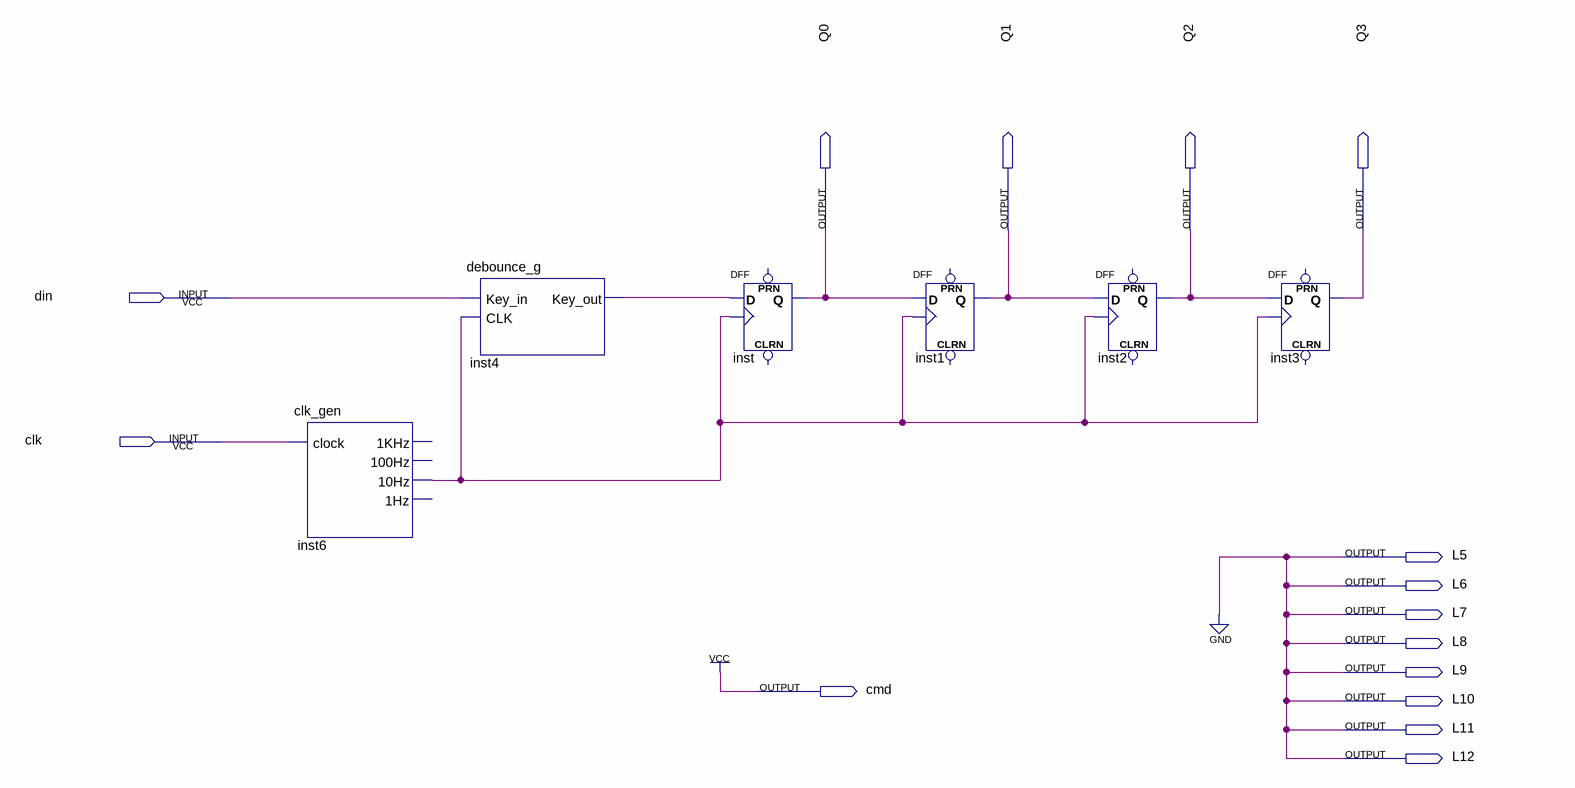
[diagram p0: schematic sheet]
// Quartus schematic shift.bdf as structural Verilog: 6 symbols, 15 pins
module shift (
  input  din,
  input  clk,
  output Q0,
  output Q1,
  output Q2,
  output Q3,
  output L5,
  output L6,
  output L7,
  output L8,
  output L9,
  output cmd,
  output L10,
  output L11,
  output L12
);

  wire inst4_key_out, inst6_10hz;

  clk_gen inst6 (.clock(clk), .\10Hz (inst6_10hz));  // open: 1KHz, 100Hz, 1Hz
  debounce_g inst4 (.Key_in(din), .CLK(inst6_10hz), .Key_out(inst4_key_out));
  DFF inst (.CLK(inst6_10hz), .D(inst4_key_out), .Q(Q0));  // open: CLRN, PRN
  DFF inst1 (.CLK(inst6_10hz), .D(Q0), .Q(Q1));  // open: CLRN, PRN
  DFF inst2 (.CLK(inst6_10hz), .D(Q1), .Q(Q2));  // open: CLRN, PRN
  DFF inst3 (.CLK(inst6_10hz), .D(Q2), .Q(Q3));  // open: CLRN, PRN

  assign cmd = 1'b1;
  assign L5 = 1'b0;
  assign L6 = 1'b0;
  assign L7 = 1'b0;
  assign L8 = 1'b0;
  assign L9 = 1'b0;
  assign L10 = 1'b0;
  assign L11 = 1'b0;
  assign L12 = 1'b0;
endmodule
